# EasyEDA Pro project STM32科协学习板.eprj, board PCB1
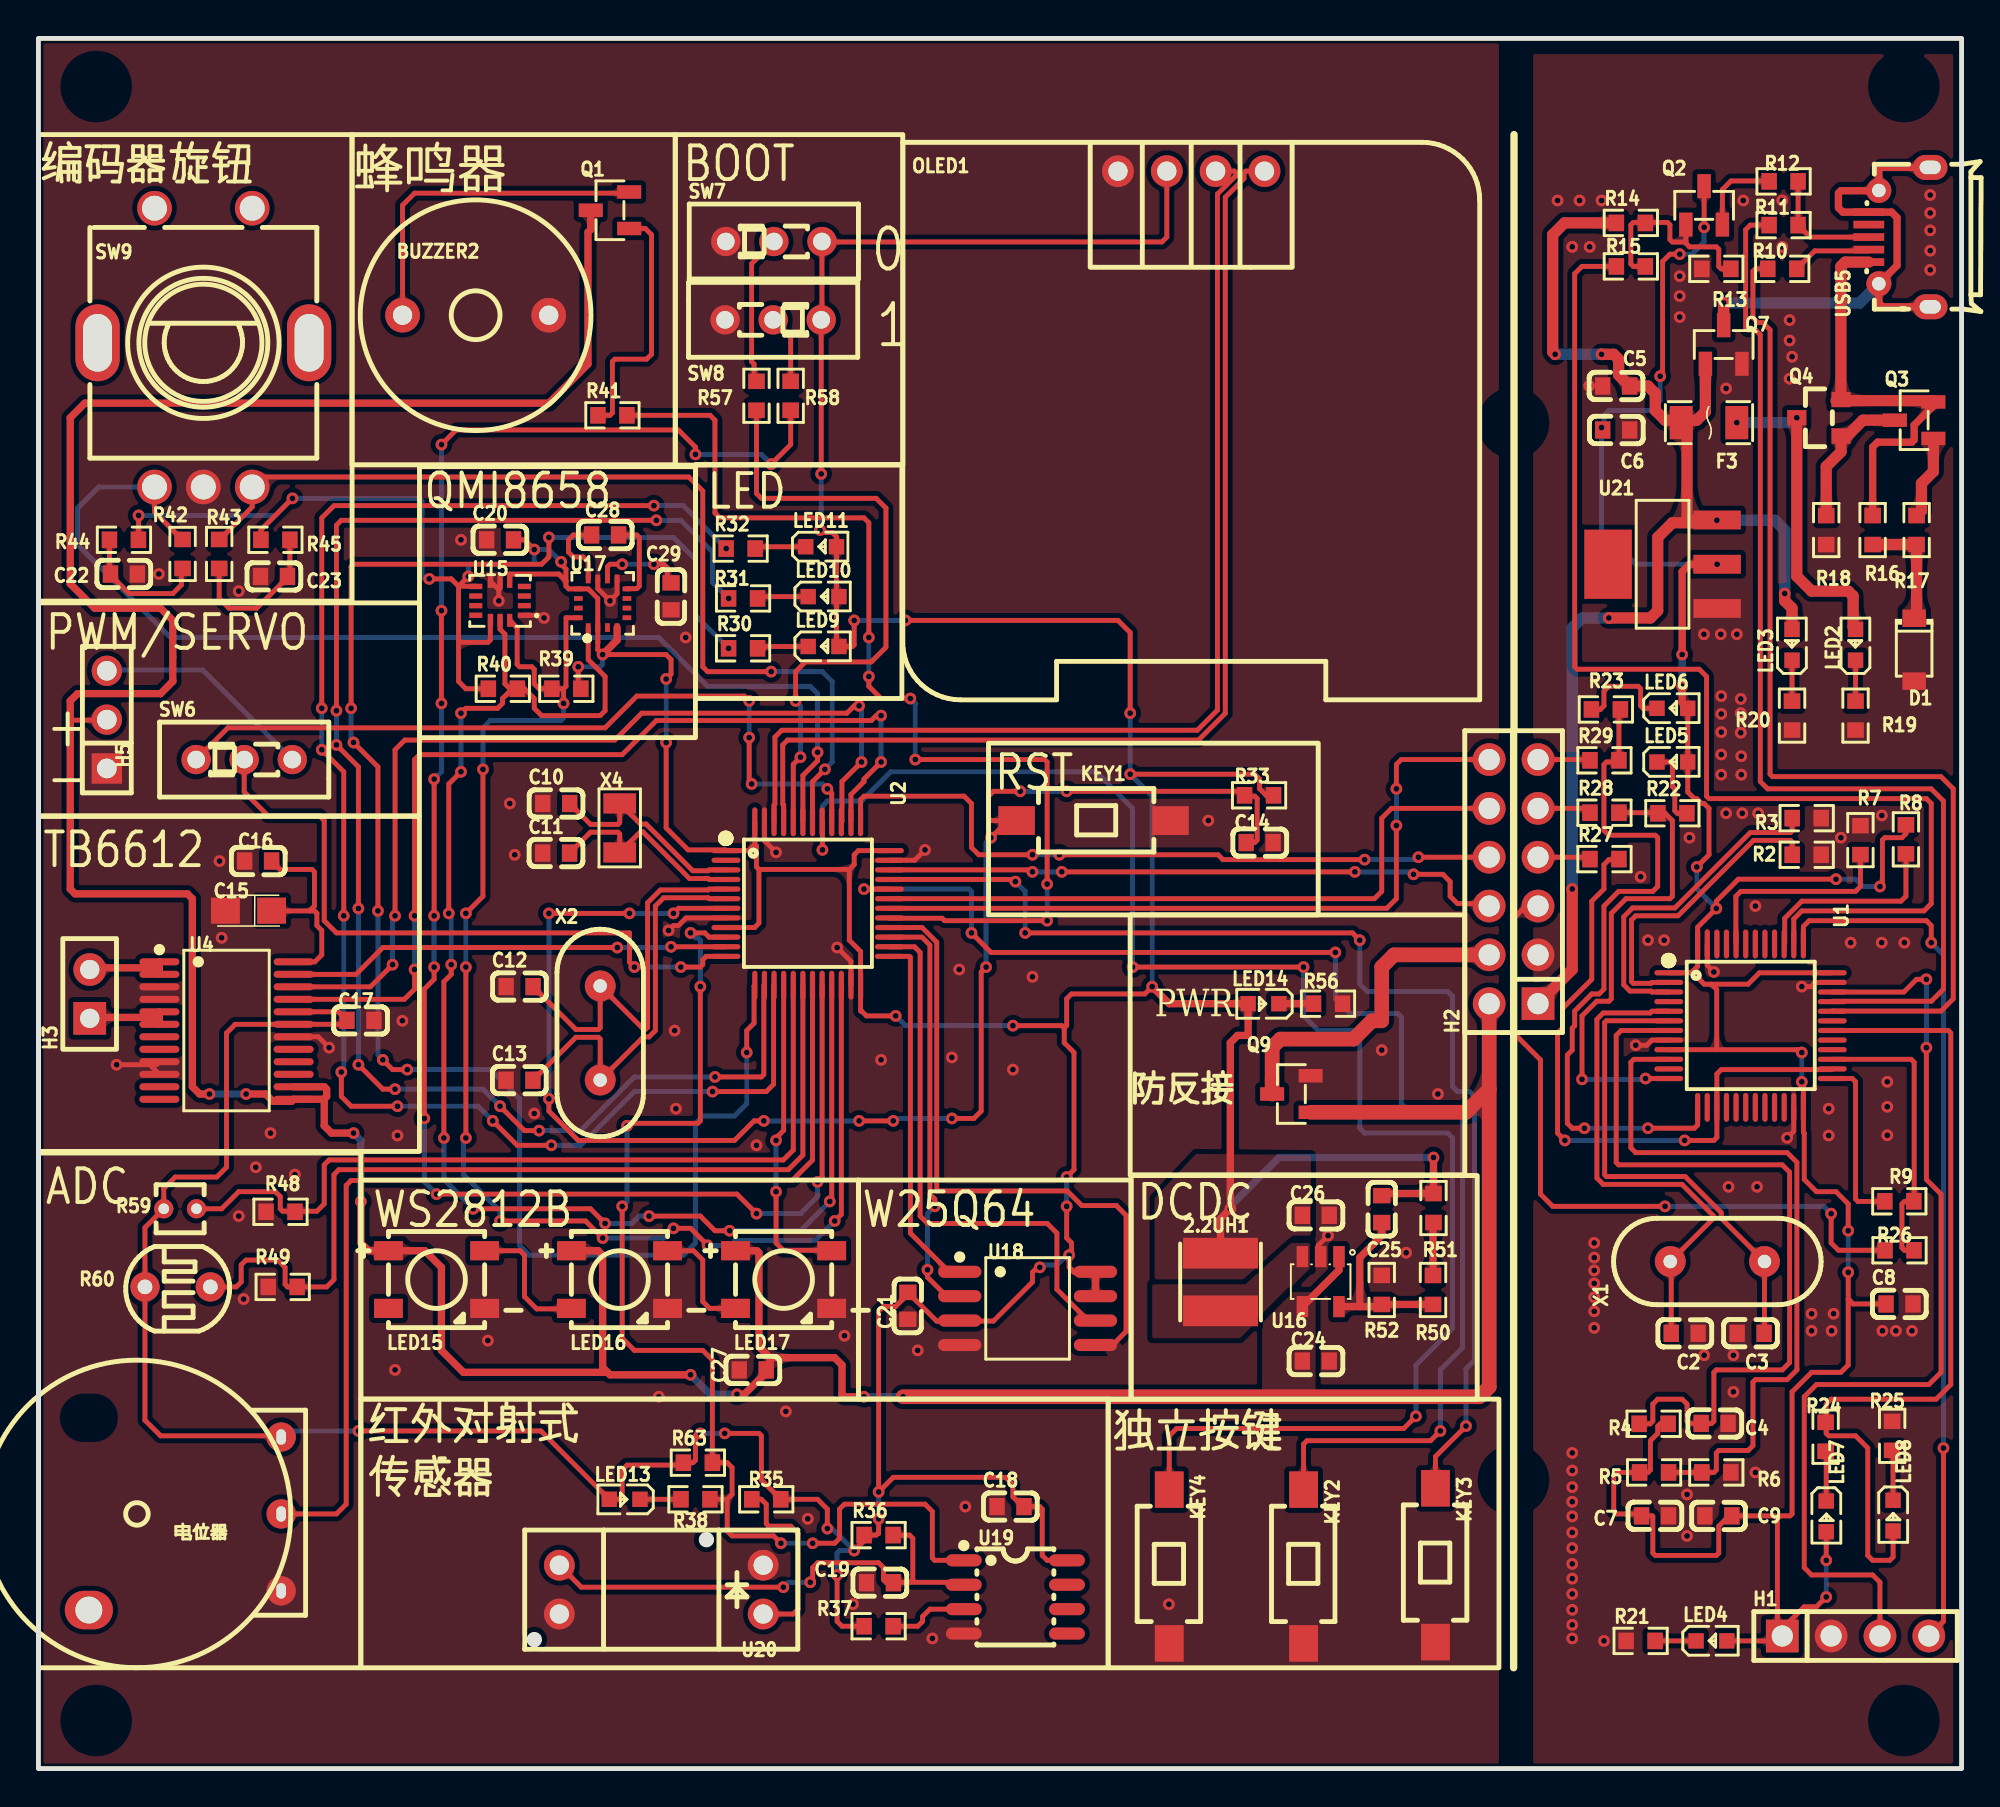
[diagram p1: board, top side]
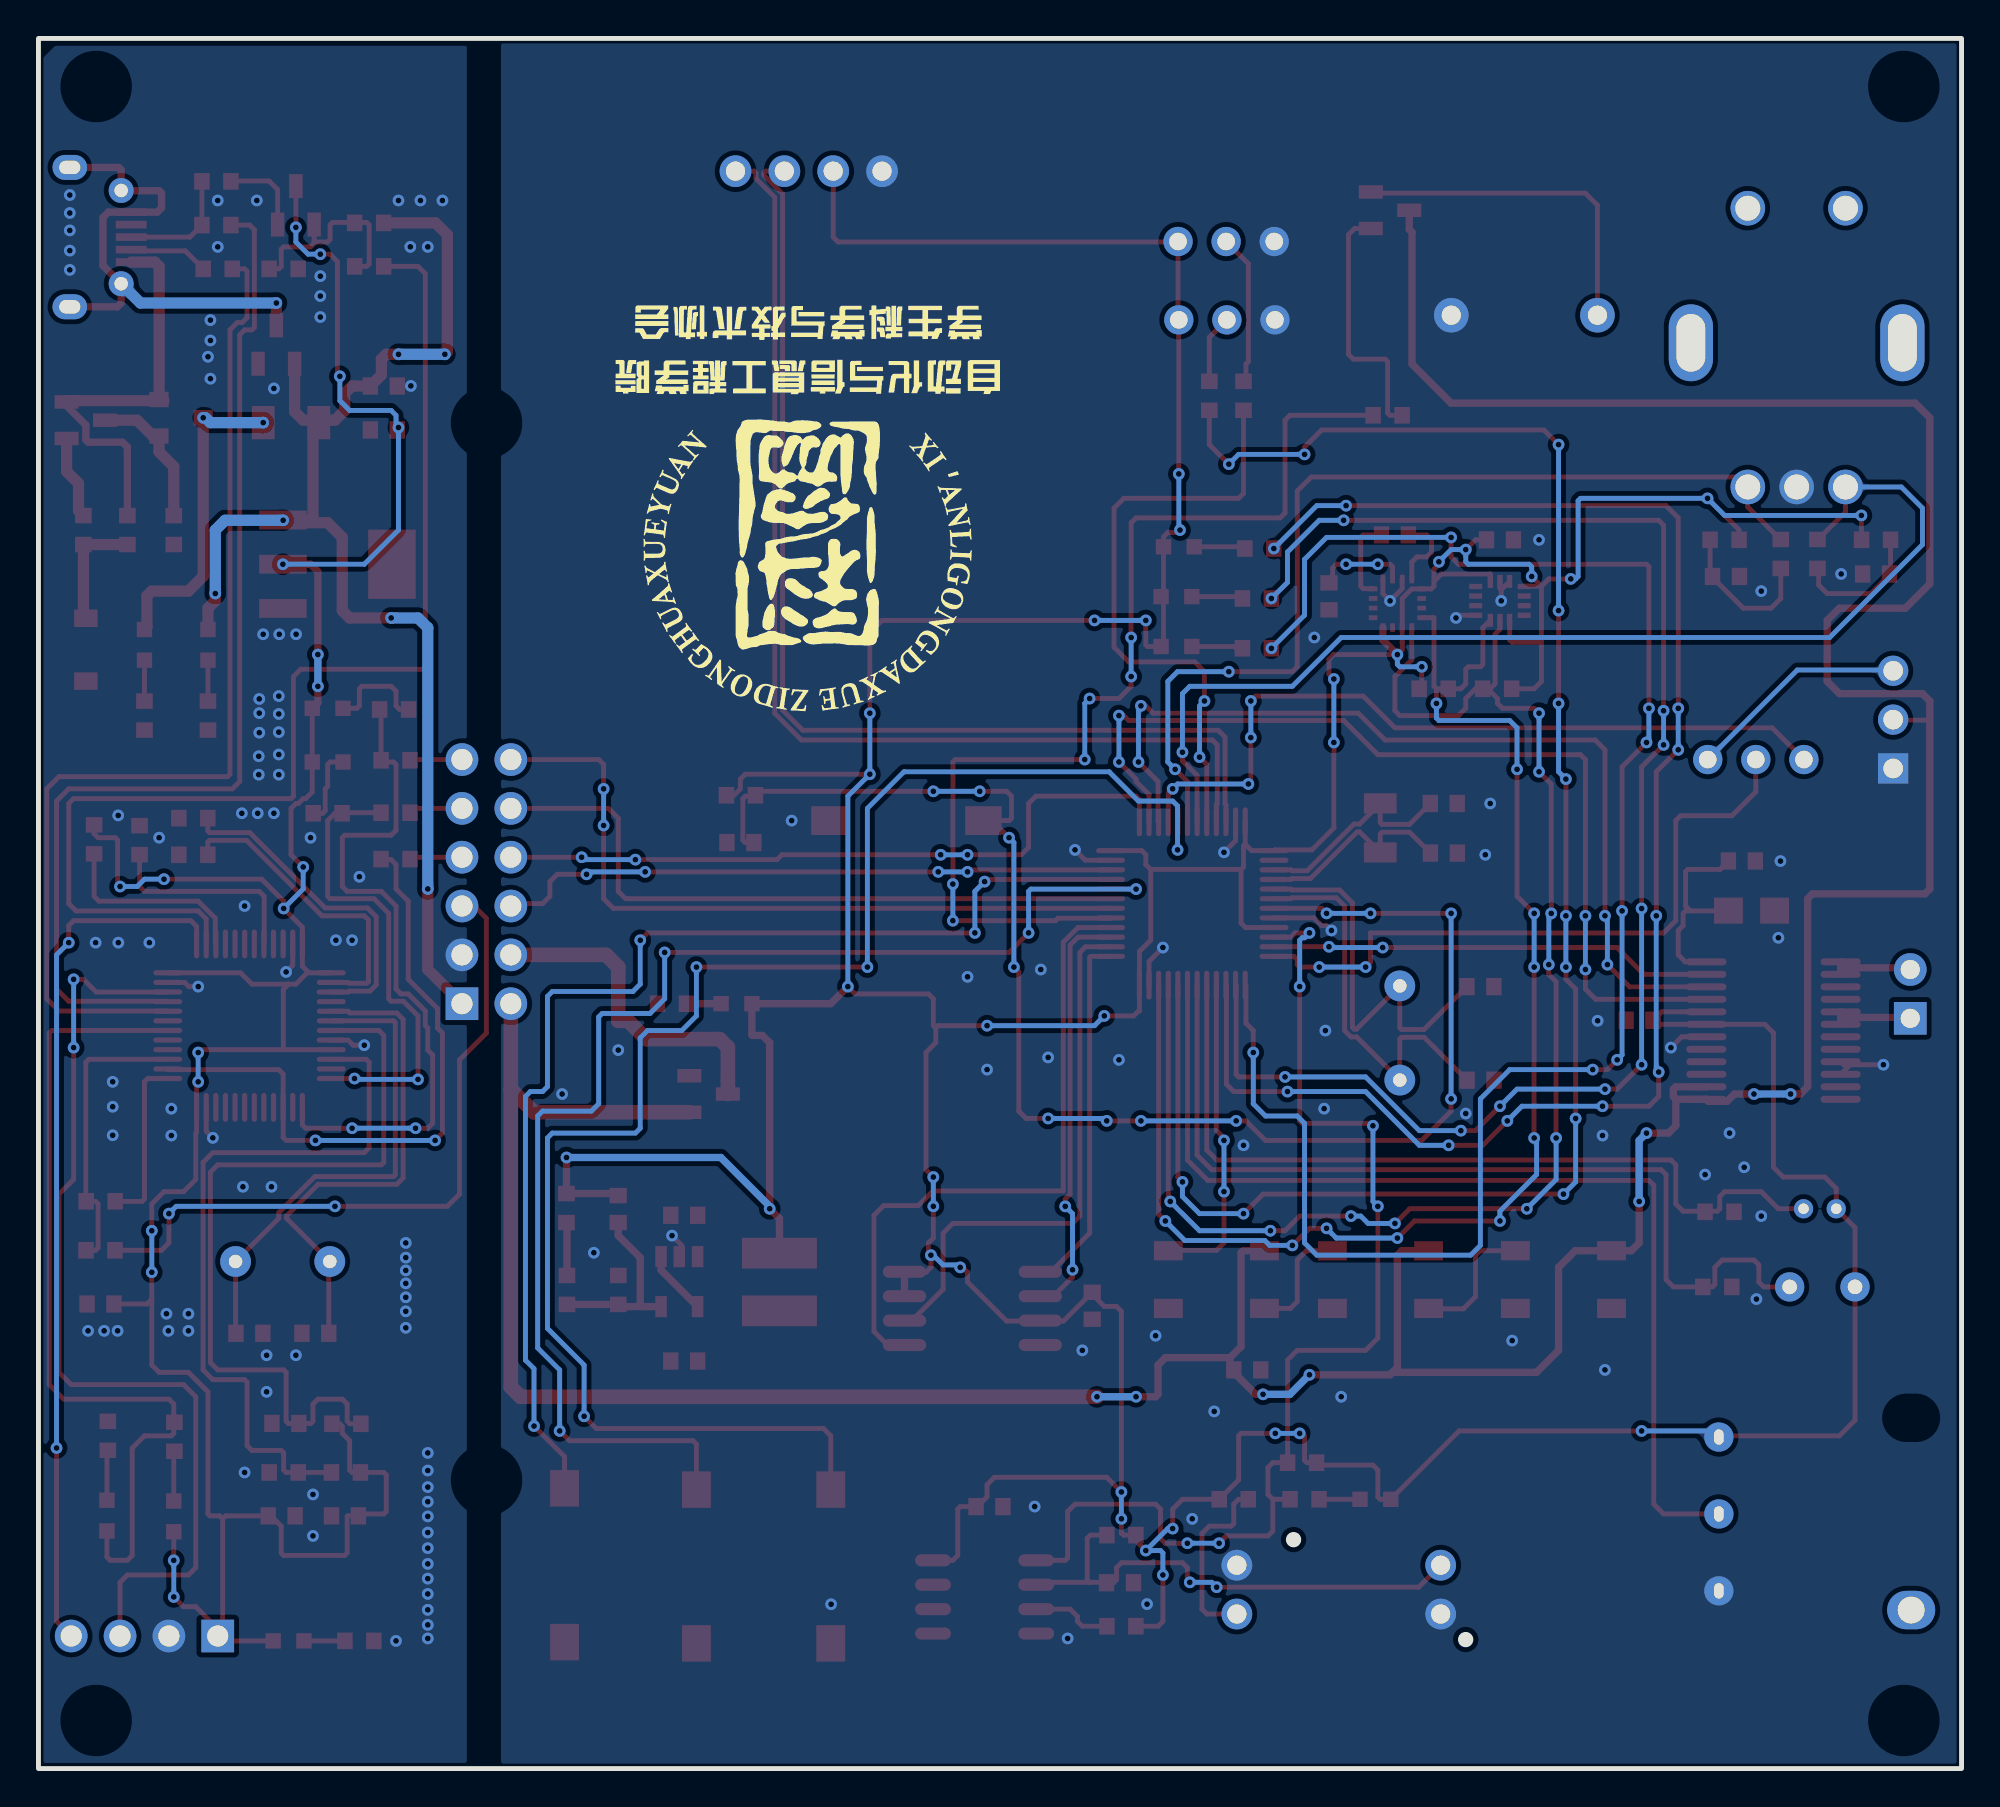
[diagram p2: board, bottom side, seen from below]

Outline 100 x 90 mm; copper layers: Top Layer, Bottom Layer. Coordinates in mm from the lower left corner of the outline.
Outline path: rectangle 0,90 100,0
Stack: Top Layer 0.035mm / Dielectric1 1.51mm FR4 er 4.5 / Bottom Layer 0.035mm

## Design rules (mm)
net OSC_IN: DP2
net OSC_OUT: DP2
net PB8: DP1
net PB9: DP1
template: 自定义配置
spacing copperThickness1oz (default): track to track 0.102, other pairs 0.152 to 0.3
spacing copperThickness2oz: track to track 0.203, other pairs 0.152 to 0.3
track width copperThickness1oz (default): min 0.127, default 0.254, max 2.54
track width copperThickness2oz: min 0.203, default 0.254, max 2.54
differential pair differentialPair (default): width min 0.127, default 0.254, max 2.54; gap min 0.152, default 0.152
via viaSize (default): diameter min 0.5, default 0.61, max 10; hole min 0.3, default 0.305, max 6.3

## Placement (name value [footprint] x y rotation side)
2.2UH1  2.2UH  [IND-SMD_L4.0-W4.0_FNR40XXS]  61.47 25.31 90 top
BUZZER2  2.7kHz  [BUZ-TH_BD12.0-P7.60-D0.6-FD]  22.73 75.6 0 top
C2  20pF  [C0603]  85.6 22.64 180 top
C3  20pF  [C0603]  89.03 22.64 0 top
C4  100nF  [C0603]  87.16 17.95 180 top
C5  10uF  [C0603]  82.04 71.92 0 top
C6  100nF  [C0603]  82.04 69.63 180 top
C7  100nF  [C0603]  84.06 13.15 0 top
C8  100nF  [C0603]  96.77 24.17 0 top
C9  100nF  [C0603]  87.35 13.15 180 top
C10  20pF  [C0603]  26.92 50.2 0 top
C11  20pF  [C0603]  26.92 47.62 0 top
C12  20pF  [C0603]  25.02 40.68 0 top
C13  20pF  [C0603]  25.01 35.81 0 top
C14  100nF  [C0603]  63.5 48.17 180 top
C15  10uF  [CASE-A_3216]  10.92 44.63 180 top
C16  100nF  [C0603]  11.42 47.21 180 top
C17  100nF  [C0603]  16.74 38.92 180 top
C18  100nF  [C0603]  50.55 13.63 0 top
C19  100nF  [C0603]  43.76 9.67 0 top
C20  100nF  [C0603]  24 63.92 0 top
C21  100nF  [C0603]  45.21 24.07 90 top
C22  100nF  [C0603]  4.44 62.14 0 top
C23  100nF  [C0603]  12.25 62.01 0 top
C24  22uF  [C0603]  66.42 21.2 180 top
C25  20pF  [C0603]  69.85 29.1 90 top
C26  22uF  [C0603]  66.42 28.78 180 top
C27  100nF  [C0603]  37.14 20.74 180 top
C28  220nF  [C0603]  29.46 64.17 180 top
C29  4.7uF  [C0603]  32.89 60.98 90 top
D1  二极管  [SOD-123_L2.7-W1.6-LS3.7-RD]  97.54 58.2 270 top
F3  nSMD010  [F1206]  86.87 70.01 180 top
H1  -  [HDR-TH_4P-P2.54-V-F]  94.49 6.9 0 top
H2  -  [HDR-TH_12P-P2.54-V-M-R2-C6-S2.54]  76.71 46.14 90 top
H3  -  [HDR-TH_2P-P2.54-V-F]  2.67 40.3 90 top
H5  -  [HDR-TH_3P-P2.54-V-F]  3.56 54.57 90 top
KEY1  KEY  [SW-SMD_L6.0-W3.3-LS8.0]  54.86 49.31 180 top
KEY2  KEY  [SW-SMD_L6.0-W3.3-LS8.0]  65.79 10.51 270 top
KEY3  KEY  [SW-SMD_L6.0-W3.3-LS8.0]  72.64 10.58 270 top
KEY4  KEY  [SW-SMD_L6.0-W3.3-LS8.0]  58.8 10.51 270 top
LED2  KT-0603R  [LED0603-RD]  94.49 58.46 90 top
LED3  KT-0603R  [LED0603-RD]  91.19 58.46 90 top
LED4  KT-0603R  [LED0603-RD]  87 6.64 0 top
LED5  KT-0603R  [LED0603-RD]  84.96 52.36 0 top
LED6  KT-0603R  [LED0603-RD]  84.96 55.16 0 top
LED7  KT-0603R  [LED0603-RD]  92.96 13.12 270 top
LED8  KT-0603R  [LED0603-RD]  96.44 13.16 270 top
LED9  KT-0603R  [LED0603-RD]  40.83 58.37 0 top
LED10  KT-0603R  [LED0603-RD]  40.83 60.96 0 top
LED11  KT-0603R  [LED0603-RD]  40.7 63.56 0 top
LED13  KT-0603R  [LED0603-RD]  30.48 14.01 180 top
LED14  KT-0603R  [LED0603-RD]  63.7 39.79 180 top
LED15  XL-5050RGBC-WS2812B  [LED-SMD_4P-L5.0-W5.0-BL_XL-5050RGBC]  20.7 25.44 270 top
LED16  XL-5050RGBC-WS2812B  [LED-SMD_4P-L5.0-W5.0-BL_XL-5050RGBC]  30.21 25.44 270 top
LED17  XL-5050RGBC-WS2812B  [LED-SMD_4P-L5.0-W5.0-BL_XL-5050RGBC]  38.75 25.44 270 top
OLED1  -  [0.96OLED_4P]  59.94 83.09 0 top
Q1  PNP  [SOT-23-3_L2.9-W1.3-P1.90-LS2.4-BR]  29.72 81.06 0 top
Q2  null  [SOT-23-3_L2.9-W1.3-P1.90-LS2.4-BR]  86.61 81.32 270 top
Q3  PNP三极管  [SOT-23-3_L2.9-W1.3-P1.90-LS2.4-BR]  97.54 70.14 0 top
Q4  PMOS  [SOT-23_L2.9-W1.3-P1.90-LS2.4-BR]  92.58 70.27 0 top
Q7  NMOS  [SOT-23-3_L2.9-W1.3-P1.90-LS2.4-BR]  87.63 74.08 270 top
Q9  NMOS  [SOT-23-3_L2.9-W1.3-P1.90-LS2.4-BR]  65.15 35.09 0 top
R2  10K  [R0603]  91.95 47.53 180 top
R3  10K  [R0603]  91.95 49.44 180 top
R4  100K  [R0603]  83.99 17.94 0 top
R5  100K  [R0603]  84.01 15.4 180 top
R6  100K  [R0603]  87.25 15.4 180 top
R7  10K  [R0603]  94.74 48.3 90 top
R8  4.7K  [R0603]  97.11 48.34 90 top
R9  10K  [R0603]  96.77 29.51 0 top
R10  10R  [R0603]  90.68 78.02 0 top
R11  10R  [R0603]  90.75 80.29 0 top
R12  1.5K  [R0603]  90.75 82.56 0 top
R13  36K  [R0603]  87.25 78.02 180 top
R14  10K  [R0603]  82.8 80.41 0 top
R15  100R  [R0603]  82.8 78.14 0 top
R16  47K  [R0603]  95.38 64.43 270 top
R17  4.7K  [R0603]  97.66 64.43 270 top
R18  10K  [R0603]  92.96 64.43 270 top
R19  2K  [R0603]  94.49 54.77 270 top
R20  2K  [R0603]  91.19 54.77 270 top
R21  1K  [R0603]  83.31 6.64 0 top
R22  1K  [R0603]  84.96 49.69 0 top
R23  1K  [R0603]  81.51 55.1 180 top
R24  1K  [R0603]  92.93 17.26 270 top
R25  1K  [R0603]  96.39 17.31 270 top
R26  10R  [R0603]  96.77 26.96 0 top
R27  10R  [R0603]  81.43 47.31 0 top
R28  10R  [R0603]  81.43 49.72 0 top
R29  10R  [R0603]  81.43 52.45 0 top
R30  1K  [R0603]  36.64 58.28 0 top
R31  1K  [R0603]  36.64 60.87 0 top
R32  1K  [R0603]  36.51 63.46 0 top
R33  10K  [R0603]  63.47 50.63 180 top
R35  1K  [R0603]  37.85 14.01 180 top
R36  10K  [R0603]  43.69 12.14 0 top
R37  10K  [R0603]  43.69 7.4 0 top
R38  1K  [R0603]  34.16 14.01 0 top
R39  2.2K  [R0603]  27.45 56.17 180 top
R40  2.2K  [R0603]  24.15 56.17 0 top
R41  100R  [R0603]  29.84 70.39 0 top
R42  10K  [R0603]  7.49 63.18 270 top
R43  10K  [R0603]  9.4 63.18 270 top
R44  10K  [R0603]  4.44 63.92 0 top
R45  10K  [R0603]  12.32 63.92 180 top
R48  10K  [R0603]  12.59 28.96 180 top
R49  100K  [R0603]  12.7 25.06 180 top
R50  300K  [R0603]  72.52 24.9 90 top
R51  150K  [R0603]  72.54 29.16 90 top
R52  100K  [R0603]  69.85 24.9 270 top
R56  1K  [R0603]  67.06 39.79 0 top
R57  100K  [R0603]  37.34 71.41 90 top
R58  100K  [R0603]  39.12 71.41 270 top
R59  MF52A103F3950 (A1)  [RES-TH_L2.5-W2.5-P1.70-D0.3]  7.37 29.12 0 top
R60  GL5528(10-20)  [RES-TH_L5.1-W4.3-P3.40-D0.5]  7.24 25.06 90 top
R63  10K  [R0603]  34.29 15.91 0 top
SW6  SS-12D01-G3  [SW-TH_SS-12D01-GX]  10.7 52.49 0 top
SW7  SS-12D01-G3  [SW-TH_SS-12D01-GX]  38.24 79.44 0 top
SW8  SS-12D01-G3  [SW-TH_SS-12D01-GX]  38.2 75.36 180 top
SW9  EC11E15244G1  [SW-TH_EC11E15244G1]  8.57 73.92 0 top
U1  STM32F103CBT6  [LQFP-48_L7.0-W7.0-P0.50-LS9.0-BL]  89.03 38.64 270 top
U2  STM32F103C8T6  [LQFP-48_L7.0-W7.0-P0.50-LS9.0-BL]  40 45 270 top
U4  TB6612  [SSOP-24_L8.4-W5.8-P0.65-LS7.8-BL]  9.78 38.39 270 top
U15  QMI8658  [LGA-14_L3.0-W2.5-P0.50-TL]  24 60.74 180 top
U16  -  [SOT-23-5_L3.0-W1.7-P0.95-LS2.8-BR]  66.68 25.33 90 top
U17  QMC5883L  [LGA-16_L3.0-W3.0-P0.50-BL_SQ]  29.34 60.62 0 top
U18  W25Q64JVSSIQ  [SOIC-8_L5.3-W5.3-P1.27-LS8.0-BL]  51.44 23.94 270 top
U19  LM393  [SOP-8_L4.9-W3.9-P1.27-LS6.0-BL]  50.8 8.93 270 top
U20  ZOS-T1406-02(ZD)  [OPTO-TH_ZOS-T1406-02]  32.38 9.31 180 top
U21  AMS1117-3.3  [SOT-223-4_L6.5-W3.5-P2.30-LS7.0-BR]  84.46 62.65 0 top
USB5  Mirco-USB  [MICRO-USB-SMD_MICROXNJ]  96.77 79.67 90 top
X1  8MHz  [OSC-TH_L10.0-W4.5-P5.00]  87.3 26.38 90 top
X2  8MHz  [OSC-TH_L10.0-W4.5-P5.00]  29.21 38.26 0 top
X4  32.768kHz  [OSC-SMD_L3.2-W1.5]  30.23 48.93 90 top
电位器  -  [单联拨盘电位器]  7.62 13.25 90 top

## Footprints (pads in the part's own frame, mm; a bottom-side part is the same pattern mirrored in y, then rotated)
0.96OLED_4P
  round 1.65 hole 1: 1(-3.81,-0.002) 2(-1.27,0.002) 3(1.27,0.002) 4(3.81,0.002)
BUZ-TH_BD12.0-P7.60-D0.6-FD
  round 1.8 hole 1: 1(-3.8,0) 2(3.8,0)
C0603
  rect 0.8x0.9 smd: 1(-0.7,0) 2(0.7,0)
CASE-A_3216
  rect 1.5x1.359 smd: 1(-1.2,0) 2(1.2,0)
F1206
  rect 1.19x1.728 smd: 1(-1.445,0) 2(1.445,0)
HDR-TH_2P-P2.54-V-F
  rect 1.7x1.7 hole 1: 1(-1.27,0)
  round 1.7 hole 1: 2(1.27,0)
HDR-TH_3P-P2.54-V-F
  rect 1.575x1.575 hole 1.02: 1(-2.54,0)
  round 1.575 hole 1.02: 2(0,0) 3(2.54,0)
HDR-TH_4P-P2.54-V-F
  rect 1.7x1.7 hole 1.1: 1(-3.81,0)
  round 1.7 hole 1.1: 2(-1.27,0) 3(1.27,0) 4(3.81,0)
HDR-TH_12P-P2.54-V-M-R2-C6-S2.54
  rect 1.7x1.7 hole 1.1: 1(-6.35,-1.27)
  round 1.7 hole 1.1: 2(-6.35,1.27) 3(-3.81,-1.27) 4(-3.81,1.27) 5(-1.27,-1.27) 6(-1.27,1.27) 7(1.27,-1.27) 8(1.27,1.27) 9(3.81,-1.27) 10(3.81,1.27) 11(6.35,-1.27) 12(6.35,1.27)
IND-SMD_L4.0-W4.0_FNR40XXS
  rect 1.6x3.9 smd: 1(-1.5,0) 2(1.5,0)
LED0603-RD
  rect 0.8x0.8 smd: 1(-0.799,0) 2(0.799,0)
LED-SMD_4P-L5.0-W5.0-BL_XL-5050RGBC
  rect 1x1.5 smd: 1(-1.5,-2.5) 2(1.5,-2.5) 3(1.5,2.5) 4(-1.5,2.5)
LGA-14_L3.0-W2.5-P0.50-TL
  rect 0.675x0.28 smd: 1(-1.262,0.75) 2(-1.262,0.25) 3(-1.262,-0.25) 4(-1.262,-0.75) 8(1.262,-0.75) 9(1.262,-0.25) 10(1.262,0.25) 11(1.262,0.75)
  rect 0.28x0.675 smd: 5(-0.5,-1.012) 6(0,-1.012) 7(0.5,-1.012) 12(0.5,1.012) 13(0,1.012) 14(-0.5,1.012)
LGA-16_L3.0-W3.0-P0.50-BL_SQ
  rect 0.25x0.45 smd: 1(-0.75,-1.263) 2(-0.25,-1.263) 3(0.25,-1.263) 4(0.75,-1.263) 9(0.75,1.263) 10(0.25,1.263) 11(-0.25,1.263) 12(-0.75,1.263)
  rect 0.45x0.25 smd: 5(1.263,-0.75) 6(1.263,-0.25) 7(1.263,0.25) 8(1.263,0.75) 13(-1.263,0.75) 14(-1.263,0.25) 15(-1.263,-0.25) 16(-1.263,-0.75)
LQFP-48_L7.0-W7.0-P0.50-LS9.0-BL
  oval 0.27x1.5 smd: 1(-2.75,-4.25) 2(-2.25,-4.25) 3(-1.75,-4.25) 4(-1.25,-4.25) 5(-0.75,-4.25) 6(-0.25,-4.25) 7(0.25,-4.25) 8(0.75,-4.25) 9(1.25,-4.25) 10(1.75,-4.25) 11(2.25,-4.25) 12(2.75,-4.25) 25(2.75,4.25) 26(2.25,4.25) 27(1.75,4.25) 28(1.25,4.25) 29(0.75,4.25) 30(0.25,4.25) 31(-0.25,4.25) 32(-0.75,4.25) 33(-1.25,4.25) 34(-1.75,4.25) 35(-2.25,4.25) 36(-2.75,4.25)
  oval 1.5x0.27 smd: 13(4.25,-2.75) 14(4.25,-2.25) 15(4.25,-1.75) 16(4.25,-1.25) 17(4.25,-0.75) 18(4.25,-0.25) 19(4.25,0.25) 20(4.25,0.75) 21(4.25,1.25) 22(4.25,1.75) 23(4.25,2.25) 24(4.25,2.75) 37(-4.25,2.75) 38(-4.25,2.25) 39(-4.25,1.75) 40(-4.25,1.25) 41(-4.25,0.75) 42(-4.25,0.25) 43(-4.25,-0.25) 44(-4.25,-0.75) 45(-4.25,-1.25) 46(-4.25,-1.75) 47(-4.25,-2.25) 48(-4.25,-2.75)
MICRO-USB-SMD_MICROXNJ
  rect 0.4x1.6 smd: 1(-1.3,1.597) 2(-0.65,1.597) 3(0,1.597) 4(0.65,1.597) 5(1.3,1.597)
  round 1.3 hole 0.7: 6(2.425,1.074) 9(-2.425,1.073)
  oval 1.3x1.8 hole 0.7x1.1: 7(3.625,-1.597) 8(-3.625,-1.597)
OPTO-TH_ZOS-T1406-02
  round 1.6 hole 1: 1(-5.3,1.27) 2(-5.3,-1.27) 3(5.3,-1.27) 4(5.3,1.27)
OSC-SMD_L3.2-W1.5
  rect 1.05x1.7 smd: 1(-1.275,0) 2(1.275,0)
OSC-TH_L10.0-W4.5-P5.00
  round 1.6 hole 0.7: 1(0,2.45) 2(0,-2.45)
R0603
  rect 0.806x0.864 smd: 1(-0.753,0) 2(0.753,0)
RES-TH_L2.5-W2.5-P1.70-D0.3
  round 1 hole 0.55: 1(-0.85,0) 2(0.85,0)
RES-TH_L5.1-W4.3-P3.40-D0.5
  round 1.524 hole 0.762: 1(0,1.7) 2(0,-1.7)
SOD-123_L2.7-W1.6-LS3.7-RD
  rect 0.91x1.22 smd: 1(-1.635,0) 2(1.635,0)
SOIC-8_L5.3-W5.3-P1.27-LS8.0-BL
  oval 0.63x2.25 smd: 1(-1.905,-3.53) 2(-0.635,-3.53) 3(0.635,-3.53) 4(1.905,-3.53) 5(1.905,3.53) 6(0.635,3.53) 7(-0.635,3.53) 8(-1.905,3.53)
SOP-8_L4.9-W3.9-P1.27-LS6.0-BL
  oval 0.63x1.865 smd: 1(-1.905,-2.683) 2(-0.635,-2.683) 3(0.635,-2.683) 4(1.905,-2.683) 5(1.905,2.683) 6(0.635,2.683) 7(-0.635,2.683) 8(-1.905,2.683)
SOT-23-3_L2.9-W1.3-P1.90-LS2.4-BR
  rect 1.25x0.7 smd: 1(1,-0.95) 2(1,0.95) 3(-1,0)
SOT-23-5_L3.0-W1.7-P0.95-LS2.8-BR
  rect 1.1x0.6 smd: 1(1.3,-0.95) 2(1.3,0) 3(1.3,0.95) 4(-1.3,0.95) 5(-1.3,-0.95)
SOT-23_L2.9-W1.3-P1.90-LS2.4-BR
  rect 1x0.8 smd: 1(1.15,-0.95) 2(1.15,0.95) 3(-1.15,0)
SOT-223-4_L6.5-W3.5-P2.30-LS7.0-BR
  rect 2.47x0.98 smd: 1(2.835,-2.3) 2(2.835,0) 3(2.835,2.3)
  rect 2.47x3.6 smd: 4(-2.835,0)
SSOP-24_L8.4-W5.8-P0.65-LS7.8-BL
  oval 0.364x2.082 smd: 1(-3.575,-3.491) 2(-2.925,-3.491) 3(-2.275,-3.491) 4(-1.625,-3.491) 5(-0.975,-3.491) 6(-0.325,-3.491) 7(0.325,-3.491) 8(0.975,-3.491) 9(1.625,-3.491) 10(2.275,-3.491) 11(2.925,-3.491) 12(3.575,-3.491) 13(3.575,3.491) 14(2.925,3.491) 15(2.275,3.491) 16(1.625,3.491) 17(0.975,3.491) 18(0.325,3.491) 19(-0.325,3.491) 20(-0.975,3.491) 21(-1.625,3.491) 22(-2.275,3.491) 23(-2.925,3.491) 24(-3.575,3.491)
SW-SMD_L6.0-W3.3-LS8.0
  rect 1.9x1.5 smd: 1(-4,0) 2(4,0)
SW-TH_EC11E15244G1
  oval 2.3x4 hole 1.5x3: 6(5.5,0.25) 7(-5.5,0.25)
  round 1.8 hole 1.3: A(-2.54,-7.25) B(2.54,-7.25) C(0,-7.25) D(-2.54,7.25) E(2.54,7.25)
SW-TH_SS-12D01-GX
  round 1.524 hole 0.914: 1(-2.5,0) 2(0,0) 3(2.5,0)
单联拨盘电位器
  oval 2x2.5 hole 1.397: 00(-5,5)
  round 1.524 hole 0.8x0.5: 1(-4,-5) 2(0,-5) 3(4,-5)

## Nets
As in the schematic, except:
3V3: 2.2UH1.2 C17.2 C18.2 C20.2 C21.2 C25.2 C26.2 LED9.2 LED10.2 LED11.2 LED13.2 LED14.2 OLED1.2 R33.1 R35.1 R36.1 R37.1 R39.1 R40.1 R44.2 R45.2 R51.2 R59.1 R60.1 R63.1 SW7.3 SW8.1 U2.1 U2.9 U2.24 U2.36 U2.48 U4.19 U4.20 U15.5 U15.8 U15.12 U17.2 U17.4 U17.13 U18.3 U18.7 U18.8 U19.8 电位器.3
GND: BUZZER2.2 C10.1 C11.1 C12.1 C13.1 C14.1 C15.2 C16.2 C17.1 C18.1 C19.1 C20.1 C21.1 C22.2 C23.1 C24.1 C26.1 C27.2 C29.1 H5.1 KEY1.1 KEY2.2 KEY3.2 KEY4.2 LED15.3 LED16.3 LED17.3 OLED1.1 Q9.2 R48.2 R49.2 R52.1 R56.2 SW7.1 SW8.3 SW9.C U2.8 U2.23 U2.35 U2.47 U4.3 U4.4 U4.9 U4.10 U4.18 U15.1 U15.6 U15.7 U16.2 U17.9 U17.11 U18.4 U19.4 U20.2 U20.4 电位器.1
PB8: OLED1.4 U2.45
PB9: OLED1.3 U2.46

Pads without a net: LED15 2; SW9 6 7 D E; U1 4 11 14 16 17 18 19 20 21 22 28 29 40 41 42 43 45 46; U2 2; U4 7 8 11 12 15 16 17; U15 2 3 4 9 10 11; U17 3 5 6 7 14 15; U19 5 6 7; U21 4; USB5 4; 电位器 00

## Via types
v1: diameter 0.61, hole 0.305, Top Layer to Bottom Layer, 356 vias

## Routing (per net, layer and track width the routed paths; a pad name or vN(x,y) marks a point on that pad's centre or on a via; arc(x,y) is an arc through that point)
3V3: length 379
  Top Layer w0.254: v1(56.77,54.9) 56.77,59.09 56.13,59.73 v1(45.09,59.73) ; 37.47,46.77 37.47,43.98 37.24,43.75 U2.9 ; 37.47,46.77 42.16,46.77 ; 37.47,46.77 37.34,46.9 37.34,47.99 37.25,48.08 ; v1(52.07,26.07) 51.94,26.07 51.69,25.82 51.69,25.31 49.66,23.28 46.7,23.28 C21.2 45.21,24.67 44.58,24.04 43.94,24.04 43.69,23.79 v1(43.69,14.39) 44.45,15.15 50.29,15.15 50.67,14.77 50.67,14.13 51.18,13.63 C18.2 52.07,13.63 52.2,13.5 52.2,11.09 52.45,10.83 U19.8 ; U4.20 15.6,39.37 C17.2 15.83,38.72 U4.19 10.23,38.72 9.78,38.26 9.78,31.28 9.27,30.77 7.11,30.77 6.52,30.17 R59.1 5.54,28.14 R60.1 5.54,18.12 6.35,17.31 12.56,17.31 电位器.3 ; R45.2 11.57,64.44 v1(13.21,66.08) ; 42.16,46.77 42.16,43.09 42.75,42.5 U2.24 42.75,39.41 42.8,39.41 43.05,39.15 v1(44.58,39.15) ; 42.16,46.77 42.42,47.03 42.42,47.53 42.63,47.75 U2.36 ; OLED1.2 58.67,79.67 58.42,79.41 40.77,79.41 SW7.3 40.74,75.4 SW8.1 v1(40.7,67.35) ; 27.43,61.76 27.43,61.5 27.57,61.37 U17.13 28.59,61.37 29.08,60.87 29.08,59.36 U17.2 29.09,58.59 29.08,58.58 29.08,58.2 v1(29.34,57.95) 32.64,57.95 32.89,57.69 32.89,56.93 v1(32.64,56.68) ; 27.43,61.76 27.05,62.14 24.5,62.14 U15.5 ; 27.43,61.76 27.43,62.39 27.18,62.65 v1(27.18,62.78) ; 21.84,58.71 21.84,61.5 ; 21.84,58.71 21.97,58.58 23.37,58.58 23.5,58.71 23.5,59.72 U15.12 ; 21.84,58.71 21.84,56.55 22.22,56.17 R40.1 ; 21.84,61.5 21.46,61.89 v1(20.32,61.89) ; 21.84,61.5 22.73,61.5 U15.8 ; 21.84,61.5 v1(22.35,62.01) ; v1(42.42,59.73) 42.42,58.46 42.33,58.37 LED9.2 41.5,58.5 LED11.2 41.5,64.08 41.28,64.3 40.89,64.3 40.77,64.43 v1(40.64,64.43) ; 53.34,38.53 53.22,38.64 v1(50.67,38.64) ; 53.34,38.53 53.47,38.65 53.47,40.04 53.72,40.3 57.53,40.3 v1(57.91,40.68) ; 53.34,38.53 53.34,37.76 53.85,37.25 53.85,31.15 v1(53.47,30.77) ; R37.1 41.78,7.4 41.53,7.66 v1(41.53,10.07) ; v1(41.02,12.48) 41.02,13.5 40.51,14.01 R35.1 37.59,15.01 37.59,17.31 37.47,17.44 v1(35.69,17.44) ; v1(53.47,29.25) 53.47,27.6 53.72,27.34 53.72,26.83 v1(53.59,26.71) 53.59,26.07 53.85,25.82 54.97,25.82 ; R44.2 5.21,63.93 v1(5.21,65.19) ; R33.1 63.84,50.63 63.5,50.96 63.5,51.47 63.25,51.73 v1(56.77,51.73) ; v1(42.42,11.34) 42.93,11.86 R36.1 43.56,12.14 43.65,12.23 43.69,12.23 v1(43.69,12.99) ; U2.48 37.25,48.08 ; 37.25,48.08 36.92,47.75 U2.1 35.71,47.79 33.78,47.79 32.64,48.93 v1(32.64,53.38) ; v1(25.78,63.41) 25.27,63.92 C20.2 ; v1(34.42,17.44) 34.29,17.44 34.16,17.31 34.16,16.04 34.04,15.91 R63.1 33.41,15.78 30.61,15.78 30.35,15.53 30.35,14.13 30.23,14.01 LED13.2 26.12,17.56 v1(16.64,17.56) ; v1(28.07,57.31) 28.07,56.31 28.2,56.17
  Top Layer w0.381: 2.2UH1.2 61.47,28.61 v1(61.98,29.12) 61.98,37.76 62.36,38.14 62.87,38.14 62.9,38.17 LED14.2 58.8,39.79 v1(57.91,40.68) ; U18.8 54.97,24.57 ; v1(29.34,57.95) 30.09,58.7 U17.4 ; v1(72.54,31.79) R51.2 69.96,29.91 C25.2
  Bottom Layer w0.254: v1(41.53,10.07) 41.53,11.21 41.66,11.34 v1(42.42,11.34) 41.28,12.48 v1(41.02,12.48) ; v1(44.58,39.15) 45.09,38.64 v1(50.67,38.64) ; v1(53.47,29.25) v1(53.47,30.77) ; v1(52.07,26.07) 52.2,26.2 52.96,26.2 53.47,26.71 v1(53.59,26.71) ; v1(22.35,62.01) 22.35,62.52 22.48,62.65 25.65,62.65 25.78,62.78 v1(25.78,63.41) 26.54,63.41 v1(27.18,62.78) ; v1(29.34,57.95) 29.34,57.44 29.21,57.31 v1(28.07,57.31) ; v1(16.64,17.56) 12.94,17.56 电位器.3 ; v1(40.7,67.35) 40.7,64.49 v1(40.64,64.43) ; v1(34.42,17.44) v1(35.69,17.44) ; v1(5.21,65.19) 12.32,65.19 v1(13.21,66.08) 19.81,66.08 19.94,65.95 19.94,62.01 20.07,61.89 v1(20.32,61.89) ; v1(32.64,53.38) 32.77,53.38 32.64,53.5 v1(32.64,56.68) ; v1(42.42,59.73) v1(45.09,59.73) ; v1(57.91,40.68) 57.91,50.58 v1(56.77,51.73) v1(56.77,54.9) ; v1(43.69,12.99) v1(43.69,14.39)
  Bottom Layer w0.381: 61.98,29.25 64.52,31.79 v1(72.54,31.79)
5V: length 70.8
  Top Layer w0.584: v1(81.28,73.57) 81.91,73.57 82.17,73.32 82.17,72.49 C5.2 83.69,71.92 84.07,71.54 84.07,70.65 84.58,70.14 85.3,70.14 ; v1(90.81,61.12) 90.81,60.74 91.19,60.36 LED3.2 ; 85.3,70.14 86.23,70.14 86.68,70.59 Q7.1 ; 85.3,70.14 F3.2 ; v1(87.28,64.93) U21.3 ; v1(87.28,64.93) 87.15,64.81 84.96,64.81 84.2,64.05 84.2,60.23 83.82,59.85 v1(81.66,59.85) ; v1(87.28,64.93) 85.85,64.93 85.72,65.06 85.72,69.89 ; H2.1 79.76,41.57 v1(79.76,45.76) ; v1(78.87,73.57) 78.74,73.7 78.74,79.79 79.35,80.41 R14.1
  Bottom Layer w0.584: v1(78.87,73.57) v1(81.28,73.57) ; v1(81.66,59.85) 80.26,59.85 79.76,59.35 v1(79.76,45.76) ; v1(90.81,61.12) 90.81,64.43 90.3,64.93 v1(87.28,64.93)
+5V: length 221.3
  Top Layer w0.254: 1.72,54.49 1.77,54.54 2.94,54.54 3.01,54.6
  Top Layer w0.381: 38.04,21.37 37.47,21.95 37.47,26.83 37.36,26.94 LED17.1 ; 38.04,21.37 38.04,20.8 36.7,19.47 v1(36.32,19.47) ; 38.04,21.37 41.4,21.37 41.78,20.99 41.78,19.47 41.91,19.34 v1(42.93,19.34) ; 14.84,34.82 14.86,34.8 14.86,33.44 15.24,33.06 v1(16.38,33.06) ; 14.84,34.82 14.99,34.96 14.99,35.34 14.86,35.47 U4.14 ; 14.84,34.82 U4.13 13.16,34.71 12.19,34.71 11.81,35.09 v1(10.8,35.09) ; U16.1 67.62,25.93 65.72,24.03 ; Q1.3 28.72,80.06 28.57,79.92 28.57,73.06 26.54,71.03 2.41,71.03 1.65,70.27 1.65,61.63 2.92,60.36 6.35,60.36 6.98,59.73 6.98,56.55 6.35,55.92 2.03,55.92 1.65,55.54 1.65,45.76 1.91,45.5 7.75,45.5 8,45.25 8,35.47 8.38,35.09 v1(8.89,35.09) ; v1(16.76,29.5) 16.76,27.34 17.17,26.94 LED15.1 20.09,26.94 20.95,26.07 20.95,21.75 22.1,20.61 29.59,20.61 ; v1(33.91,20.48) 29.72,20.48 29.59,20.61 ; 29.59,20.61 29.34,20.87 29.34,26.71 29.11,26.94 LED16.1
  Top Layer w0.762: 75.44,35.34 75.44,19.85 74.93,19.34 v1(44.96,19.34) ; 75.44,35.34 74.23,34.14 Q9.1 ; 75.44,35.34 H2.2
  Bottom Layer w0.381: v1(36.32,19.47) 34.93,19.47 v1(33.91,20.48) ; v1(44.96,19.34) v1(42.93,19.34) ; v1(16.38,33.06) 16.76,32.68 v1(16.76,29.5) ; v1(8.89,35.09) v1(10.8,35.09)
AGND: length 6.8
  Top Layer w0.254: U1.47 86.78,41.78 v1(87.12,41.44) ; v1(83.06,37.63) 83.63,37.63 83.9,37.89 U1.8 ; v1(91.69,40.68) 92.18,40.68 92.4,40.89 U1.35 ; v1(90.93,32.81) 91.28,33.15 U1.23
  vias: v1(78.99,81.57) v1(79.76,79.16) v1(79.76,16.42) v1(79.76,15.5) v1(79.76,14.64) v1(79.76,13.88) v1(79.76,13.12) v1(79.76,12.28) v1(79.76,11.47) v1(79.76,10.65) v1(79.76,9.88) v1(79.76,9.08) v1(79.76,8.26) v1(79.76,7.47) v1(79.76,6.77) v1(80.14,81.57) v1(80.64,71.92) v1(80.66,79.16) v1(80.9,27.34) v1(80.9,26.58) v1(80.9,25.91) v1(80.9,25.24) v1(80.9,24.51) v1(80.9,23.79) v1(80.9,22.93) v1(81.28,81.57) v1(81.41,6.64) v1(83.31,46.39) v1(83.69,43.09) v1(84.53,43.09) v1(85.34,77.63) v1(85.34,76.6) v1(85.34,75.51) v1(85.72,14.26) v1(85.72,12.1) v1(85.85,48.42) v1(86.6,59.01) v1(86.61,21.5) v1(87.48,59.01) v1(87.5,55.79) v1(87.5,54.86) v1(87.5,53.91) v1(87.5,52.75) v1(87.5,51.7) v1(87.76,71.79) v1(87.76,49.69) v1(87.88,30.26) v1(88.14,21.5) v1(88.14,19.59) v1(88.32,59.01) v1(88.52,55.64) v1(88.52,54.9) v1(88.52,53.89) v1(88.55,52.66) v1(88.55,51.7) v1(88.65,81.57) v1(88.6,49.69) v1(89.28,44.87) v1(89.28,15.4) v1(89.43,49.69) v1(89.37,30.26) v1(90.68,81.57) v1(90.68,79.16) v1(91.06,75.35) v1(91.06,74.29) v1(91.06,72.3) v1(91.19,73.44) v1(92.2,23.66) v1(92.2,22.77) v1(93.09,34.33) v1(93.09,32.93) v1(93.25,22.77) v1(93.34,23.66) v1(93.73,48.42) v1(94.23,42.96) v1(95.85,42.96) v1(95.85,49.58) v1(95.88,22.77) v1(96.14,35.72) v1(96.14,34.43) v1(96.14,32.94) v1(96.59,22.77) v1(97.03,42.96) v1(97.42,22.77) v1(98.37,81.85) v1(98.37,80.92) v1(98.37,80.02) v1(98.37,78.96) v1(98.37,77.96)
GND: length 21.3
  Top Layer w0.254: U15.1 26.15,59.99 v1(26.29,59.85) ; 5.79,36.61 6.14,36.61 U4.9 ; 5.79,36.61 U4.10 ; 5.79,36.61 v1(4.06,36.61) ; U2.35 45.56,47.25 v1(46.1,47.79) ; U17.11 29.09,61.37 v1(29.72,60.74) 30.09,61.11 U17.9 ; U15.7 23.94,61.32 ; 23.94,61.32 24,61.39 U15.6 ; 23.94,61.32 v1(23.94,60.74) ; U2.23 42.25,41.99 v1(41.53,42.71) ; U16.2 66.55,26.76 66.55,27.22 v1(67.06,27.72) ; U2.8 33.67,44.25 33.27,43.85 33.02,43.85 v1(32.77,43.6) ; v1(38.35,47.66) 37.75,48.27 U2.47 ; v1(15.11,37.5) 14.55,38.07 U4.18
  vias: v1(6.26,62.14) v1(9.42,47.21) v1(9.53,43.22) v1(10.41,61.25) v1(10.41,28.74) v1(10.67,24.42) v1(11.3,31.28) v1(12.06,33.06) v1(13.33,30.9) v1(18.54,20.74) v1(18.67,32.93) v1(18.92,38.9) v1(21.97,63.92) v1(23.37,22.26) v1(24.51,50.2) v1(24.77,47.53) v1(25.78,34.07) v1(32.26,19.34) v1(33.08,38.39) v1(33.15,34.33) v1(33.66,58.84) v1(37.34,32.42) v1(38.86,18.58) v1(40,12.99) v1(41.91,22.52) v1(42.35,8.55) v1(43.81,36.87) v1(45.72,21.75) v1(46.48,6.77) v1(47.5,36.99) v1(47.88,41.57) v1(48.2,13.63) v1(50.67,36.36) v1(51.69,41.19) v1(58.78,8.55) v1(60.83,49.31) v1(69.85,37.38) v1(71.12,26.83) v1(72.77,35.09)
PGND: length 27.2
  Top Layer w0.381: USB5.8 95.9,76.04 95.7,76.24 USB5.9 96.65,78.19 96.65,80.68 96.36,80.97 USB5.5 93.82,80.97 93.6,81.19 93.6,81.95 93.73,82.08 95.69,82.08 USB5.6 95.7,83.16 95.83,83.29 USB5.7
  Top Layer w0.584: Q7.3 v1(87.63,76.24)
  Bottom Layer w0.584: v1(87.63,76.24) 94.7,76.24 USB5.9
VCC: length 152.8
  Top Layer w0.254: v1(85.34,78.78) 84.84,78.78 84.46,78.4 84.46,72.55 v1(84.33,72.43) ; v1(92.96,8.93) 92.46,8.42 91.82,8.42 90.68,7.28 H1.1 ; LED6.2 LED5.2 85.76,50.8 86.11,50.46 86.23,50.46 86.49,50.2 86.61,50.2 86.87,49.95 86.87,47.53 v1(86.23,46.9) ; 90.42,12.99 90.27,13.15 C9.1 87.91,13.15 87.38,12.61 87.38,11.21 87.25,11.09 84.07,11.09 83.95,11.21 83.95,13.12 83.92,13.15 C7.1 83.26,13.25 82.04,13.25 81.91,13.37 81.91,15.28 82.04,15.4 R5.2 83.69,15.4 83.82,15.53 83.82,17.06 84.2,17.44 84.2,17.81 84.33,17.94 R4.2 ; 90.42,12.99 90.58,13.15 91.09,13.15 91.19,13.25 91.19,19.59 92.2,20.61 93.73,20.61 94.11,20.99 94.11,24.42 ; 90.42,12.99 90.42,7.15 H1.1 ; LED7.2 v1(92.96,10.83) ; 87,40.8 86.61,40.8 85.98,41.44 ; 87,40.8 87.27,40.53 87.27,37.39 ; 87,40.8 88.9,40.8 89.49,41.39 U1.36 ; H1.1 90.42,6.64 LED4.2 ; 85.98,41.44 85.94,41.39 U1.1 ; 85.98,41.44 86.28,41.74 U1.48 86.28,43.77 v1(87.25,44.74) 87.25,45.12 88.39,46.27 v1(93.47,46.27) ; v1(95.76,45.88) 95.88,46.01 95.88,48.3 96.01,48.42 96.9,48.42 97.11,48.63 R8.2 ; v1(81.28,69.76) 81.28,69.69 C6.2 ; v1(94.11,27.98) 94.11,29.37 93.47,30.01 92.46,30.01 91.82,30.64 91.82,33.06 91.78,33.1 U1.24 91.78,35.64 v1(91.69,35.72) ; 94.11,24.42 94.36,24.17 C8.1 ; 94.11,24.42 v1(94.11,25.82) ; 87.27,37.39 91.55,37.39 v1(91.69,37.25) ; 87.27,37.39 U1.9 ; Q2.3 v1(86.61,80.17)
  Top Layer w0.381: v1(87.29,62.65) 85.85,62.65 85.47,62.27 v1(85.47,57.95) ; LED6.2 85.47,55.45 v1(85.47,56.3)
  Bottom Layer w0.254: v1(92.96,10.83) v1(92.96,8.93) ; v1(86.61,80.17) 86.61,79.41 85.98,78.78 v1(85.34,78.78) ; v1(87.25,44.74) 86.23,45.76 v1(86.23,46.9) ; v1(87.29,62.65) 83.06,62.65 81.28,64.43 v1(81.28,69.76) 81.41,69.89 81.41,70.39 81.66,70.65 83.82,70.65 84.33,71.16 v1(84.33,72.43) ; v1(94.11,27.98) v1(94.11,25.82) ; v1(93.47,46.27) 94.49,46.27 94.87,45.88 v1(95.76,45.88) ; v1(91.69,37.25) v1(91.69,35.72)
  Bottom Layer w0.381: v1(85.47,57.95) v1(85.47,56.3)
ADC1: length 43.3
  Top Layer w0.254: R59.2 9.53,29.12 10.41,30.01 12.32,30.01 12.57,29.75 12.57,29.12 12.7,28.99 13.31,28.99 R48.1 13.37,28.99 14.48,28.99 14.86,29.37 14.86,31.41 15.11,31.66 38.74,31.66 39.25,32.17 U2.17
ADC2: length 47.9
  Top Layer w0.254: R60.2 10.29,25.06 10.54,25.31 10.54,26.2 10.8,26.45 12.45,26.45 12.83,26.07 12.83,25.18 12.95,25.06 R49.1 14.99,25.06 15.37,25.44 15.37,30.9 15.62,31.15 38.99,31.15 39.75,31.91 U2.18
ADC3: length 54.1
  Top Layer w0.254: 电位器.2 15.49,13.25 16,13.75 16,30.34 16.26,30.59 39.19,30.59 40.25,31.65 U2.19
BOOT0: length 31.9
  Top Layer w0.254: U2.44 39.25,52.24 v1(39.62,52.61) ; R57.1 37.34,66.33 37.59,66.08 43.56,66.08 44.07,65.57 44.07,58.33 43.31,57.57 39.88,57.57 39.37,57.06 v1(39.37,55.54)
  Bottom Layer w0.254: v1(39.37,55.54) 39.62,55.28 v1(39.62,52.61)
BOOT1: length 93
  Top Layer w0.254: v1(20.07,33.82) 20.07,40.55 20.57,41.06 v1(20.57,41.69) ; v1(38.1,67.86) 39.12,68.87 R58.2 ; v1(20.95,68.87) 21.72,69.63 33.27,69.63 34.16,68.74 v1(34.16,68.36) ; v1(20.57,44.36) v1(20.57,51.47) ; v1(20.7,29.88) 36.32,29.88 v1(37.34,28.87) ; v1(20.95,60.23) v1(20.95,55.41) ; v1(40.51,30.52) 40.75,30.75 U2.20
  Bottom Layer w0.254: v1(37.34,28.87) 39.62,28.87 40.51,29.75 v1(40.51,30.52) ; v1(20.07,33.82) 20.07,30.52 v1(20.7,29.88) ; v1(34.16,68.36) 37.59,68.36 v1(38.1,67.86) ; v1(20.95,55.41) 20.95,51.85 v1(20.57,51.47) ; v1(20.95,60.23) v1(20.95,68.87) ; v1(20.57,41.69) v1(20.57,44.36)
CGND: length 17.4
  Top Layer w0.381: 64.13,35.84 64.15,35.82
  Top Layer w0.762: H2.4 70.49,42.33 69.85,41.69 69.85,38.9 69.34,38.9 68.39,37.95 64.58,37.95 64.15,37.52 Q9.3
CLK: length 28.5
  Top Layer w0.254: U2.26 45.55,42.75 45.85,42.45 45.85,28.74 46.23,28.36 52.45,28.36 52.96,27.85 52.96,24.93 54.59,23.3 U18.6
CS: length 18.3
  Top Layer w0.254: 47.37,25.82 45.34,27.85 45.34,42.2 45.29,42.25 U2.25
DI: length 33.6
  Top Layer w0.254: U2.28 45.94,43.75 46.71,42.98 46.71,30.05 53.49,30.05 54.25,29.29 56.05,29.29 56.55,28.78 56.55,22.73 55.93,22.11 55.35,22.11
DO: length 22.1
  Top Layer w0.254: U2.27 45.94,43.25 46.35,42.84 46.35,29.88 46.61,29.63 v1(46.61,29.25) ; v1(46.23,25.94) 46.23,25.56 47.14,24.65 48.16,24.65
  Bottom Layer w0.254: v1(46.61,29.25) 46.23,28.87 v1(46.23,25.94)
LED_STLINK: length 43.9
  Top Layer w0.254: 92.96,18.05 92.96,17.44 93.09,17.31 94.49,17.31 95.12,16.67 95.12,11.09 95.38,10.83 96.27,10.83 96.44,11.01 LED8.2 ; 92.96,18.05 R24.1 ; 92.96,18.05 92.96,18.96 93.22,19.21 98.68,19.21 99.44,19.98 99.44,38.26 99.31,38.39 U1.30
MOTOR: length 48.4
  Top Layer w0.254: v1(18.54,44.36) 18.54,53 19.05,53.5 29.97,53.5 31.37,54.9 42.04,54.9 42.42,55.28 v1(42.67,55.28) ; v1(18.42,41.82) 17.26,40.67 U4.22 ; U2.39 41.78,49.28 41.78,51.34 v1(42.8,52.36)
  Bottom Layer w0.254: v1(42.8,52.36) 42.8,55.16 v1(42.67,55.28) ; v1(18.54,44.36) 18.42,44.23 v1(18.42,41.82)
MOTOR2: length 49.8
  Top Layer w0.254: U2.38 42.25,50.67 42.93,51.34 42.93,51.47 v1(43.81,52.36) ; v1(43.81,54.77) 43.56,54.77 43.31,54.52 32.13,54.52 30.35,52.74 19.81,52.74 19.56,52.49 v1(19.56,44.36) ; U4.21 19.02,40.02 19.56,40.55 v1(19.56,41.57)
  Bottom Layer w0.254: v1(43.81,54.77) v1(43.81,52.36) ; v1(19.56,41.57) v1(19.56,44.36)
NRST: length 78.7
  Top Layer w0.254: v1(49.53,48.42) 50.42,49.31 ; 50.42,49.31 KEY1.2 ; 50.42,49.31 49.53,49.31 49.4,49.44 49.4,50.58 49.66,50.84 v1(51.05,50.84) ; v1(37.72,33.69) 37.21,33.69 36.19,32.68 28.07,32.68 26.54,34.2 v1(26.54,34.83) ; v1(47.5,33.82) 48.64,33.82 49.02,34.2 49.02,41.44 v1(49.28,41.69) ; v1(42.67,33.69) v1(44.45,33.69) ; v1(53.47,50.84) 62.51,50.84 R33.2 62.76,50.58 63.25,50.58 63.37,50.46 63.37,48.3 63.25,48.17 C14.2 ; v1(30.73,44.49) v1(26.54,44.49) ; v1(33.02,44.49) 33.28,44.75 U2.7
  Bottom Layer w0.254: v1(49.28,41.69) 49.28,48.17 v1(49.53,48.42) ; v1(51.05,50.84) v1(53.47,50.84) ; v1(47.5,33.82) 44.58,33.82 v1(44.45,33.69) ; v1(33.02,44.49) v1(30.73,44.49) ; v1(37.72,33.69) v1(42.67,33.69) ; v1(26.54,34.83) v1(26.54,44.49)
OSC_IN: length 20.9
  Top Layer w0.254: C12.2 27.95,38.45 29.12,38.45 29.21,38.54 X2.1 31.46,38.47 31.58,38.47 31.67,38.56 31.67,45.04 32.34,45.7 34.83,45.7 34.87,45.75 U2.5
OSC_OUT: length 20.9
  Top Layer w0.254: U2.6 34.87,45.25 34.83,45.3 32.51,45.3 32.08,44.87 32.08,38.39 31.75,38.06 31.46,38.06 X2.2 29.21,37.95 29.12,38.04 27.94,38.04 25.71,35.81
PA0: length 59.9
  Top Layer w0.254: U19.1 46.61,10.83 46.48,10.96 46.48,13.37 46.1,13.75 41.91,13.75 41.66,13.5 41.66,11.97 41.4,11.72 v1(40.26,11.72) ; 35.81,14.01 36.07,14.26 36.07,15.66 35.81,15.91 R63.2 35.04,21.25 34.54,21.75 30.99,21.75 30.35,22.39 v1(30.35,29.25) ; 35.81,14.01 R38.2 ; 35.81,14.01 35.81,12.36 36.07,12.1 38.23,12.1 v1(38.61,11.72) ; v1(33.91,43.47) 34.65,43.47 34.87,43.25 U2.10 ; v1(30.61,33.44) 30.73,33.56 34.29,33.56 34.42,33.69 v1(34.42,40.68)
  Bottom Layer w0.254: v1(30.35,29.25) 30.61,29.5 v1(30.61,33.44) ; v1(33.91,43.47) 34.16,43.22 34.29,43.22 34.42,43.09 v1(34.42,40.68) ; v1(38.61,11.72) v1(40.26,11.72)
PA1: length 23.1
  Top Layer w0.254: U4.23 13.27,41.31 16.51,41.31 17.91,42.71 v1(30.1,42.71) ; U2.11 v1(32.89,42.75)
  Bottom Layer w0.254: v1(32.89,42.75) 32.85,42.71 v1(30.1,42.71)
PA2: length 34.8
  Top Layer w0.254: v1(30.99,41.69) 30.73,41.95 30.73,43.47 15.49,43.47 14.86,44.11 14.86,49.31 14.61,49.57 11.94,49.57 10.7,50.81 SW6.2 ; v1(33.4,41.69) 34.42,41.69 34.54,41.82 34.54,42.07 34.72,42.25 U2.12
  Bottom Layer w0.254: v1(33.4,41.69) v1(30.99,41.69)
PA3: length 92.1
  Top Layer w0.254: v1(26.54,64.05) 26.54,63.03 26.16,62.65 16.38,62.65 16.26,62.52 v1(16.26,55.16) ; v1(17.65,44.61) 17.65,52.11 v1(16.38,53.38) ; v1(19.18,36.36) 18.42,36.36 v1(17.91,36.87) ; v1(36.83,37.25) 36.83,38.39 37.21,38.77 37.21,40.71 U2.13
  Bottom Layer w0.254: v1(16.26,55.16) 16.26,53.5 v1(16.38,53.38) ; v1(36.83,37.25) 36.83,34.58 36.19,33.95 34.54,33.95 34.16,33.56 34.16,27.34 33.53,26.71 25.53,26.71 25.02,27.22 25.02,34.83 23.5,36.36 v1(19.18,36.36) ; v1(35.89,58.28) 34.16,60 34.16,62.9 33.02,64.05 v1(26.54,64.05) ; v1(17.91,36.87) 17.65,37.12 v1(17.65,44.61)
PA4: length 80
  Top Layer w0.254: v1(18.54,35.34) 17.91,35.34 v1(16.64,36.61) ; v1(15.49,55.03) 15.49,64.68 15.75,64.93 v1(32.13,64.93) ; v1(16.64,44.74) 16.64,52.11 v1(15.49,53.25) ; v1(24,34.45) 25.27,33.18 v1(26.03,33.18) ; v1(35.18,35.98) 37.59,35.98 37.72,36.11 37.72,40.72 U2.14
  Bottom Layer w0.254: v1(16.64,44.74) v1(16.64,36.61) ; v1(24,34.45) 23.11,35.34 v1(18.54,35.34) ; v1(32.13,64.93) 33.4,64.93 35.05,63.28 35.05,61.7 v1(35.89,60.87) ; v1(26.03,33.18) 28.19,33.18 30.99,35.98 v1(35.18,35.98) ; v1(15.49,55.03) v1(15.49,53.25)
PA5: length 82.8
  Top Layer w0.254: v1(23.62,33.69) 24.89,32.42 v1(26.67,32.42) ; v1(18.67,34.45) 16.26,34.45 15.75,34.96 v1(15.75,36.23) ; U2.15 38.23,40.73 38.23,35.6 37.85,35.22 v1(35.05,35.22) ; v1(14.73,53) 15.88,51.85 v1(15.88,44.36) ; v1(32,65.7) 15.37,65.7 14.73,65.06 v1(14.73,55.16)
  Bottom Layer w0.254: v1(32,65.7) 33.53,65.7 v1(35.76,63.46) ; v1(18.67,34.45) 22.86,34.45 v1(23.62,33.69) ; v1(15.88,44.36) 15.88,36.36 v1(15.75,36.23) ; v1(14.73,55.16) v1(14.73,53) ; v1(35.05,35.22) 30.99,35.22 28.19,32.42 v1(26.67,32.42)
PA6: length 16.6
  Top Layer w0.254: LED17.4 41.22,26.96 38.74,26.96 38.35,27.34 v1(38.35,30.01) ; U2.16 38.75,33.2 38.35,32.8 v1(38.35,32.68)
  Bottom Layer w0.254: v1(38.35,32.68) v1(38.35,30.01)
PA8: length 55.4
  Top Layer w0.254: v1(52.45,44.11) 47.12,44.11 46.99,44.23 44.27,44.23 U2.29 ; v1(45.34,55.66) 43.81,55.66 43.18,56.3 v1(43.18,56.81) ; v1(52.45,46.01) 52.45,52.36 52.32,52.49 v1(45.59,52.49) ; v1(43.18,58.84) 43.18,64.81 42.93,65.06 35.43,65.06 35.18,65.31 35.18,70.14 34.93,70.39 R41.2
  Bottom Layer w0.254: v1(43.18,58.84) v1(43.18,56.81) ; v1(52.45,46.01) v1(52.45,44.11) ; v1(45.59,52.49) 45.59,55.41 v1(45.34,55.66)
PA11: length 69.3
  Top Layer w0.254: v1(67.44,42.45) 49.53,42.45 v1(48.51,43.47) ; v1(72.9,17.56) 72.39,17.06 65.97,17.06 65.79,16.88 KEY2.1 ; U2.32 v1(42.93,45.75)
  Bottom Layer w0.254: v1(42.93,45.75) 48.39,45.75 48.51,45.63 v1(48.51,43.47) ; v1(72.9,17.56) 72.9,20.74 74.04,21.88 74.04,33.95 73.79,34.2 71.25,34.2 70.87,34.58 70.87,39.1 70.69,39.28 68.2,39.28 67.44,40.04 v1(67.44,42.45)
PA12: length 61.7
  Top Layer w0.254: U2.33 50.69,46.25 v1(50.8,46.14) ; v1(51.31,43.47) 68.33,43.47 v1(68.71,43.09) ; v1(74.23,17.82) 72.64,16.23 KEY3.1
  Bottom Layer w0.254: v1(51.31,43.47) 51.31,45.63 v1(50.8,46.14) ; v1(74.23,17.82) 74.23,20.8 74.68,21.25 74.68,34.96 74.42,35.22 73.79,35.22 73.53,35.47 73.53,40.17 73.28,40.42 69.09,40.42 68.71,40.8 v1(68.71,43.09)
PB4: length 40.5
  Top Layer w0.254: v1(37.08,51.22) 36.96,51.34 v1(36.96,53.63) ; v1(36.96,55.54) 36.7,55.79 31.12,55.79 29.46,54.14 9.85,54.14 SW6.1 ; v1(41.02,50.96) 41.25,50.73 U2.40
  Bottom Layer w0.254: v1(41.02,50.96) 40.77,51.22 v1(37.08,51.22) ; v1(36.96,55.54) v1(36.96,53.63)
PB5: length 85.5
  Top Layer w0.254: KEY4.1 58.8,17.31 59.18,17.69 70.99,17.69 v1(71.63,18.32) ; U2.41 40.77,49.23 v1(40.77,47.79) ; v1(56.9,41.69) v1(65.79,41.69)
  Bottom Layer w0.254: v1(56.9,41.69) 56.9,49.95 54.99,51.85 44.32,51.85 42.8,50.33 41.02,50.33 40.77,50.08 v1(40.77,47.79) ; v1(65.79,41.69) 65.79,39.15 66.55,38.39 68.33,38.39 68.71,38.01 68.71,33.31 68.96,33.06 73.28,33.06 73.53,32.8 73.53,22.9 71.63,20.99 v1(71.63,18.32)
PB6: length 51.2
  Top Layer w0.254: 11.58,67.19 33.81,67.19 34.54,66.46 34.54,57.31 34.8,57.06 v1(38.1,57.06) ; R43.1 9.43,63.94 11.11,65.62 11.11,67.18 ; U2.42 40.25,51.34 v1(40.89,51.98)
  Bottom Layer w0.254: v1(38.1,57.06) 40.77,57.06 41.28,56.55 41.28,52.36 v1(40.89,51.98)
PB7: length 58.9
  Top Layer w0.254: R42.1 7.46,63.94 6.03,65.37 6.03,67.18 ; v1(40.51,52.87) 40.51,52.43 39.75,51.66 U2.43
  Bottom Layer w0.254: SW9.A 3.13,66.67 2.03,65.57 2.03,63.66 6.86,58.84 32.26,58.84 34.8,56.3 40.13,56.3 40.51,55.92 v1(40.51,52.87)
PB8: length 57.3
  Top Layer w0.254: OLED1.4 62.78,83.1 62.69,83.01 62.69,82.71 61.71,81.74 61.71,54.89 60.32,53.5 38.96,53.5 38.7,53.25 38.7,50.17 38.75,50.13 U2.45
PB9: length 57.5
  Top Layer w0.254: U2.46 38.25,50.13 38.3,50.17 38.3,53.66 38.65,54.01 60.26,54.01 61.31,55.06 61.31,81.91 62.28,82.88 62.28,83.01 62.19,83.1 OLED1.3
PC14: length 11.1
  Top Layer w0.254: C10.2 28.71,49.11 30.14,49.11 30.23,49.2 X4.2 31.3,49.14 31.59,49.14 34.03,46.7 34.83,46.7 34.87,46.75 U2.3
PC15: length 11.1
  Top Layer w0.254: U2.4 34.87,46.25 34.83,46.3 33.86,46.3 31.43,48.73 31.3,48.73 X4.1 30.23,48.62 30.14,48.71 28.7,48.71 C11.2
RXD: length 35.4
  Top Layer w0.254: H2.10 70.36,49.95 69.85,49.44 69.85,45.63 69.47,45.25 U2.31
SCL: length 75.9
  Top Layer w0.254: 24.64,56.17 R40.2 25.27,56.17 25.78,55.66 25.78,55.16 26.16,54.77 29.21,54.77 29.46,55.03 29.46,56.81 28.59,57.68 U17.1 ; 24.64,56.17 24.13,55.66 24.13,55.41 23.88,55.16 22.22,55.16 v1(21.97,54.9) ; 24.64,56.17 24.51,56.17 24.26,56.42 24.26,59.01 24,59.27 U15.13 ; v1(21.34,44.49) 21.34,51.22 v1(21.97,51.85) ; v1(35.94,27.98) 35.18,27.98 34.42,28.74 v1(31.75,28.74) ; v1(21.08,32.8) 21.08,40.93 21.46,41.31 v1(21.46,41.82) ; v1(41.15,29.5) 41.25,29.6 U2.21 ; v1(22.61,29.12) 28.7,29.12 v1(29.46,28.36)
  Bottom Layer w0.254: v1(35.94,27.98) 39.62,27.98 v1(41.15,29.5) ; v1(21.97,51.85) v1(21.97,54.9) ; v1(22.61,29.12) 21.08,30.64 v1(21.08,32.8) ; v1(31.75,28.74) 31.24,28.74 30.86,28.36 v1(29.46,28.36) ; v1(21.46,41.82) 21.46,44.36 v1(21.34,44.49)
SDA: length 74.3
  Top Layer w0.254: v1(41.4,28.48) 41.75,28.83 U2.22 ; v1(27.31,55.41) 27.31,56.17 ; 27.31,56.17 R39.2 26.03,56.17 25.78,56.42 25.78,57.19 25.65,57.31 25.02,57.31 24.89,57.44 24.89,59.34 U15.14 ; 27.31,56.17 27.43,56.3 27.43,59.87 U17.16 ; v1(23.11,51.98) 23.11,45.38 v1(22.22,44.49) ; v1(24,28.48) 28.45,28.48 v1(29.34,27.6) ; v1(33.02,28.1) 33.91,28.1 v1(34.8,27.22) ; v1(22.22,32.8) v1(22.22,41.69)
  Bottom Layer w0.254: v1(33.02,28.1) 32.51,27.6 v1(29.34,27.6) ; v1(24,28.48) 24,28.99 22.1,30.9 22.1,32.68 v1(22.22,32.8) ; v1(23.11,51.98) 23.11,54.14 23.5,54.52 27.18,54.52 27.31,54.65 v1(27.31,55.41) ; v1(22.22,41.69) v1(22.22,44.49) ; v1(34.8,27.22) 35.97,27.22 36.23,27.47 40.39,27.47 v1(41.4,28.48)
ST_SWCLK: length 45.3
  Top Layer w0.254: v1(99.06,16.67) 99.06,7.66 H1.4 ; v1(98.43,42.96) 98.43,43.85 98.17,44.11 92.07,44.11 91.78,43.81 U1.37
  Bottom Layer w0.254: v1(99.06,16.67) 99.06,42.33 v1(98.43,42.96)
ST_SWDIO: length 49.5
  Top Layer w0.254: v1(98.17,37.5) 98.17,30.64 98.93,29.88 98.93,20.61 98.3,19.98 92.46,19.98 91.82,19.34 91.82,10.45 92.2,10.07 95.38,10.07 95.76,9.69 H1.3 ; U1.34 97,40.39 97.66,41.06 v1(98.17,41.06)
  Bottom Layer w0.254: v1(98.17,41.06) v1(98.17,37.5)
STL_USBD+: length 56.3
  Top Layer w0.254: R11.1 89.02,80.29 88.77,80.05 88.77,74.97 88.9,74.84 89.28,74.84 89.53,74.59 89.53,51.34 89.92,50.96 98.43,50.96 99.06,50.33 99.06,40.55 98.43,39.92 93.3,39.92 U1.33
STL_USBD-: length 54.8
  Top Layer w0.254: U1.32 93.29,39.41 98.93,39.41 99.57,40.04 99.57,50.96 98.93,51.6 90.17,51.6 90.04,51.73 90.04,74.84 89.66,75.22 89.41,75.22 89.15,75.47 89.15,77.89 89.28,78.02 R10.1
SWCLK: length 36.7
  Top Layer w0.254: v1(51.69,47.53) 48.9,47.53 48.51,47.92 48.51,50.2 48.13,50.58 42.93,50.58 42.75,50.41 U2.37 ; v1(68.96,47.28) 61.59,47.28 61.34,47.53 v1(53.09,47.53) ; v1(71.75,47.41) H2.8
  Bottom Layer w0.254: v1(51.69,47.53) v1(53.09,47.53) ; v1(71.75,47.41) 71.63,47.28 v1(68.96,47.28)
SWDIO: length 32.4
  Top Layer w0.254: v1(51.69,46.65) 51.59,46.75 U2.34 ; v1(53.21,46.65) v1(68.45,46.65) ; H2.6 75.31,45 73.79,45 73.41,45.38 73.41,46.14 73.03,46.52 v1(71.5,46.52)
  Bottom Layer w0.254: v1(68.45,46.65) 71.37,46.65 v1(71.5,46.52) ; v1(51.69,46.65) v1(53.21,46.65)
T_JTCK_SWCLK: length 33.8
  Top Layer w0.254: U1.26 93.24,36.36 87.5,36.36 87.28,36.13 U1.15 87.28,32.83 87.12,32.68 v1(85.6,32.68) ; v1(79.38,32.68) 78.99,33.06 78.99,38.26 79.25,38.52 79.25,39.53 80.77,41.06 80.77,45.12 81.41,45.76 81.41,47.03 81.66,47.28 82.16,47.28 R27.2
  Bottom Layer w0.254: v1(85.6,32.68) v1(79.38,32.68)
T_JTMS_SWDIO: length 15.2
  Top Layer w0.254: R26.2 97.03,26.96 96.9,27.09 96.9,29.37 97.03,29.5 97.51,29.5 97.54,29.53 97.54,36.74 97.38,36.89 U1.27
T_RXD: length 35.9
  Top Layer w0.254: R23.1 82.18,55.02 R29.2 82.1,52.36 81.53,52.36 81.41,52.23 81.41,48.81 81.66,48.55 84.07,48.55 84.2,48.42 84.2,45.88 83.95,45.63 82.17,45.63 81.41,44.87 81.41,40.55 81.15,40.3 80.77,40.3 79.88,39.41 79.88,38.64 79.76,38.52 79.76,37.38 79.5,37.12 79.5,33.56 79.76,33.31 v1(80.39,33.31) ; U1.13 86.28,33.48 86.11,33.31 v1(83.69,33.31)
  Bottom Layer w0.254: v1(83.69,33.31) v1(80.39,33.31)
T_TXD: length 24.6
  Top Layer w0.254: v1(80.26,35.85) 80.26,39.15 81.03,39.92 81.66,39.92 81.79,40.04 81.79,44.49 82.55,45.25 84.84,45.25 84.96,45.38 84.96,49.31 84.58,49.69 R22.1 84.18,49.72 R28.2 ; U1.12 v1(83.57,35.89)
  Bottom Layer w0.254: v1(83.57,35.89) 83.52,35.85 v1(80.26,35.85)
TXD: length 38.5
  Top Layer w0.254: v1(70.61,49.06) 70.61,45.25 70.11,44.75 U2.30 ; H2.12 70.87,52.49 70.61,52.23 v1(70.61,50.96)
  Bottom Layer w0.254: v1(70.61,49.06) v1(70.61,50.96)
USB_RENUMN: length 61.9
  Top Layer w0.254: R15.1 80.26,78.14 79.88,77.76 79.88,57.31 80.01,57.19 86.36,57.19 86.74,56.81 86.74,50.58 86.87,50.46 98.17,50.46 98.43,50.2 98.43,45 98.04,44.61 91.69,44.61 91.28,44.2 U1.38
$1N931: length 16
  Top Layer w0.254: R2.2 91.19,48.19 91.1,48.28 89.18,48.28 85.26,44.36 83.06,44.36 82.84,44.14 82.84,40.94 82.93,40.85 83.85,40.85 83.9,40.89 U1.2
$1N970: length 17.3
  Top Layer w0.254: R3.2 91.19,48.78 91.1,48.69 89.01,48.69 85.09,44.77 82.89,44.77 82.44,44.31 82.44,40.77 82.76,40.44 83.85,40.44 83.9,40.39 U1.3
$1N1046: length 26.1
  Top Layer w0.254: C2.2 84.9,26.33 X1.1 87.1,28.62 87.1,28.75 85.46,30.39 81.37,30.39 81.04,30.72 81.04,38.98 81.37,39.31 83.81,39.31 83.9,39.39 U1.5
$1N1051: length 25.4
  Top Layer w0.254: 84.78,38.9 81.53,38.9 81.44,38.81 81.44,30.89 81.53,30.8 85.63,30.8 87.5,28.92 87.5,28.62 X1.2 89.75,22.66 C3.2
$1N1278: length 41.3
  Top Layer w0.254: U1.7 82.3,38.39 82.04,38.14 82.04,31.53 82.17,31.41 90.68,31.41 91.06,31.03 91.06,21.12 90.68,20.74 87.25,20.74 87.12,20.61 87.12,18.07 87,17.94 86.47,17.94 C4.2 85.84,17.95 85.72,18.07 85.72,18.96 85.47,19.21 84.2,19.21 83.95,18.96 83.95,18.07 83.81,17.94 R4.1
$1N1456: length 37.6
  Top Layer w0.254: U1.10 82.96,36.89 82.8,36.74 82.8,32.3 83.06,32.04 90.93,32.04 91.44,31.53 91.44,20.74 90.93,20.23 89.28,20.23 89.15,20.1 89.15,16.8 88.9,16.55 87.38,16.55 87.25,16.42 87.25,15.53 87.12,15.4 R6.2 R5.1
$1N1752: length 10.8
  Top Layer w0.254: U1.44 88.26,42.91 88.26,45.38 88.52,45.63 94.49,45.63 94.74,45.88 R7.1
$1N1820: length 10.3
  Top Layer w0.254: U1.39 90.81,42.92 90.81,44.23 91.69,45.12 96.85,45.12 97.11,45.38 97.11,47.58
$1N1929: length 9
  Top Layer w0.254: R9.1 96,29.5 94.62,29.5 94.49,29.63 94.49,35.72 94.32,35.89 U1.25
$1N2269: length 4.2
  Top Layer w0.254: R10.2 92.37,78.95 95.15,78.95 95.18,78.98 USB5.2
$1N2364: length 6.2
  Top Layer w0.254: R12.2 R11.2 92.12,79.67 USB5.3
$1N2410: length 4.4
  Top Layer w0.254: R12.1 89.97,82.59 88.01,82.59 87.56,82.14 Q2.2
$1N2449: length 11.1
  Top Layer w0.254: 83.58,80.43 84.71,80.43 84.84,80.3 84.84,79.54 84.96,79.41 85.6,79.41 85.66,79.48 ; 83.58,80.43 R14.2 ; 83.58,80.43 82.93,80.43 82.8,80.3 82.8,78.27 82.93,78.14 R15.2 ; 85.66,79.48 85.66,79.35 85.85,79.16 87.25,79.16 87.38,79.03 87.38,78.14 87.5,78.02 R13.1 ; 85.66,79.48 Q2.1
$1N3256: length 2.1
  Top Layer w0.254: LED2.1 R19.1
$1N3443: length 2.1
  Top Layer w0.254: R20.1 LED3.1
$1N3731: length 2.1
  Top Layer w0.254: R21.2 LED4.1
$1N3770: length 4
  Top Layer w0.254: LED5.1 84.84,52.36 84.96,52.23 84.96,51.09 85.09,50.96 85.09,49.82 85.22,49.69 R22.2
$1N3809: length 5.3
  Top Layer w0.254: R23.2 81.22,55.1 81.41,55.28 81.41,56.04 81.66,56.3 83.19,56.3 83.31,56.17 83.31,55.28 83.44,55.16 LED6.1
$1N3848: length 2.6
  Top Layer w0.254: R24.2 92.96,16.47 LED7.1
$1N3897: length 2.6
  Top Layer w0.254: R25.2 96.44,16.51 LED8.1
$1N4274: length 36.5
  Top Layer w0.254: R26.1 93.6,26.96 93.22,27.34 v1(93.22,28.87) ; H2.5 77.34,44.87 76.71,44.23 76.71,38.26 78.1,36.87 78.1,29.88 78.74,29.25 v1(84.58,29.25)
  Bottom Layer w0.254: v1(84.58,29.25) 92.84,29.25 v1(93.22,28.87)
$1N4313: length 2.7
  Top Layer w0.254: R27.1 80.58,47.41 H2.7
$1N4352: length 2.8
  Top Layer w0.254: H2.9 80.45,49.95 R28.1
$1N4391: length 2.7
  Top Layer w0.254: R29.1 80.64,52.49 H2.11
$1N6201: length 3
  Top Layer w0.254: LED9.1 37.49,58.37 R30.2 37.73,58.28
$1N6284: length 2.7
  Top Layer w0.254: LED10.1 37.49,60.96 R31.2
$1N6367: length 2.7
  Top Layer w0.254: R32.2 37.36,63.56 LED11.1
$1N7024: length 4.3
  Top Layer w0.381: 6.29,41.65 2.75,41.65 H3.2 ; 6.29,41.65 U4.2 ; 6.29,41.65 U4.1
$1N7031: length 4.2
  Top Layer w0.381: 2.74,39.08 6.29,39.08 ; 6.29,39.08 U4.6 ; 6.29,39.08 U4.5
$1N7219: length 10.9
  Top Layer w0.254: 14.1,44.61 14.35,44.87 14.35,46.65 14.22,46.77 12.56,46.77 C16.1 ; 14.1,44.61 12.14,44.61 C15.1 ; 14.1,44.61 14.35,44.61 14.48,44.49 14.48,43.85 14.73,43.6 14.73,42.33 14.37,41.97 U4.24
$1N8042: length 26.7
  Top Layer w0.254: v1(38.74,9.44) 28.23,9.44 U20.3 ; 45.34,9.69 45.47,9.82 45.47,11.97 45.3,12.14 R36.2 ; 45.34,9.69 47.99,9.69 U19.2 ; 45.34,9.69 44.48,9.69 44.46,9.67 44.09,9.67 43.94,9.82 43.94,10.45 43.69,10.71 40.51,10.71 40.26,10.45 40.26,9.82 v1(40.13,9.69)
  Bottom Layer w0.254: v1(40.13,9.69) 38.99,9.69 v1(38.74,9.44)
$1N8188: length 2.1
  Top Layer w0.254: LED13.1 R38.1
$1N11873: length 13.2
  Top Layer w0.254: Q1.1 31.56,80.11 31.88,79.79 31.88,73.57 31.62,73.32 29.97,73.32 29.84,73.19 29.84,70.52 29.72,70.39 R41.1
$1N12045: length 7
  Top Layer w0.254: R42.2 7.43,62.37 7.43,61.57 6.98,61.12 4.71,61.12 3.75,62.09 C22.1 3.69,62.19 R44.1
$1N12084: length 8
  Top Layer w0.254: R45.1 13.07,62.14 C23.2 12.95,61.96 11.35,60.36 9.91,60.36 9.4,60.87 R43.2
$1N13209: length 9.8
  Top Layer w0.381: U16.5 68.71,24.03 ; 68.71,24.03 68.71,26.58 69.85,27.73 C25.1 ; 68.71,24.03 69.74,24.03 R52.2 R50.1
$1N13248: length 2.8
  Top Layer w0.381: R51.1 72.52,28.38 R50.2
$1N13973: length 1.8
  Top Layer w0.381: LED14.1 R56.1
$1N14191: length 12.1
  Bottom Layer w0.254: SW6.3 8.54,57.14 3.01,57.14
$1N14332: length 7.9
  Top Layer w0.254: R57.2 37.21,72.29 37.21,73.06 37.08,73.19 37.08,78.28 SW7.2
$1N14371: length 3.6
  Top Layer w0.254: R58.1 39.12,74.45 SW8.2
$1N14600: length 6
  Top Layer w0.254: LED16.4 34.06,26.94 34.54,26.45 34.54,24.29 34.9,23.94 LED17.2
$1N14605: length 7
  Top Layer w0.254: LED16.2 27.69,23.91 25.91,23.91 25.27,24.55 25.27,26.71 25.04,26.94 LED15.4
$1N14999: length 4.1
  Top Layer w0.254: U17.12 28.59,62.76 28.32,63.03 27.81,63.03 27.56,63.28 27.56,63.92 27.81,64.17 C28.2
$1N15003: length 4.4
  Top Layer w0.254: C28.1 31.12,64.17 31.24,64.05 31.24,61.5 31.12,61.38 30.61,61.38 U17.8
$1N15040: length 4.8
  Top Layer w0.254: U17.10 29.59,62.52 29.72,62.65 v1(30.35,62.65) ; 32.7,61.51 32.7,62.46 32.51,62.65 v1(32,62.65)
  Bottom Layer w0.254: v1(30.35,62.65) v1(32,62.65)
$1N16611: length 17.8
  Top Layer w0.254: Q1.2 30.66,81.95 19.56,81.95 18.93,81.33 BUZZER2.1
$1N16712: length 4.2
  Top Layer w0.254: R37.2 45.72,7.4 45.97,7.66 45.97,7.91 46.35,8.29 U19.3
$1N16792: length 9.6
  Top Layer w0.254: U20.1 39.24,8.04 39.5,8.29 39.5,12.23 39.12,12.61 37.97,12.61 37.85,12.74 37.85,13.75 37.59,14.01 R35.2
$1N17153: length 22.1
  Top Layer w0.381: 98.74,71.09 97.54,69.89 97.54,69.12 97.41,69 95.63,69 95.38,68.74 R16.1
  Top Layer w0.584: 98.74,71.09 Q3.2 98.47,71.16 93.47,71.16 ; USB5.1 93.95,78.37 93.73,78.14 93.73,71.22 Q4.2
$1N17154: length 7.6
  Top Layer w0.584: R18.1 92.96,67.73 93.73,68.5 Q4.1 94.05,69.32 94.87,70.14 Q3.3
$1N17155: length 4.4
  Top Layer w0.584: R17.1 97.92,65.43 97.92,66.86 98.54,67.47 Q3.1
$1N17156: length 6.2
  Top Layer w0.584: R16.2 R17.2 97.66,59.97 D1.1
$1N17582: length 16.6
  Top Layer w0.584: v1(91.43,70.27) 91.43,62.02 92.2,61.25 94.11,61.25 94.36,61 94.36,59.38 LED2.2
  Bottom Layer w0.584: v1(88.31,70.01) 91.06,70.01 91.31,70.27 v1(91.43,70.27)

## Copper pours and planes (outline as drawn; the poured copper is in the pictures)
3V3 on Top Layer: 58.04,25.44 62.93,25.44 65.22,27.72 66.17,27.72 66.17,31.92 60.19,31.98 58.04,29.68
+5V on Top Layer: 65.25,24.8 66.41,24.8 66.41,19.09 63.63,19.09 63.63,23.17
AGND on Top Layer: 77.72,89.19 99.57,89.19 99.57,-0.22 77.72,-0.22
AGND on Bottom Layer: 77.72,89.62 77.72,0.29 99.69,0.29 99.82,0.16 99.82,88.94 99.14,89.62
GND on Top Layer: 0.25,89.83 75.95,89.83 75.95,0.16 0.25,0.16
GND on Top Layer: 44.45,52.11 51.69,52.11 51.69,39.03 44.45,39.03
GND on Bottom Layer: 50.8,32.04 76.33,32.04 76.33,5.24 50.8,5.24
GND on Bottom Layer: 0.25,89.83 75.95,89.83 75.95,0.16 0.25,0.16
$1N13469 on Top Layer: 57.91,25.19 57.91,22.39 62.48,22.39 66.04,25.94 66.17,25.94 66.17,27.34 65.15,27.34 62.75,25.19

Small or netless copper shapes (teardrops, artwork), in the pictures only: 646 on Top Layer, 222 on Bottom Layer

## Text on the board
Top Silkscreen Layer: TB6612 | PWM/SERVO | ADC | WS2812B | QMI8658 | BOOT | LED | W25Q64 | RST | DCDC | + | - | 0 | 1 | 防反接 | PWR | 红外对射式 / 传感器 | 编码器旋钮 | 独立按键 | 蜂鸣器
